# EAGLE schematic rc2014_8255 (EAGLE 7.6.0)
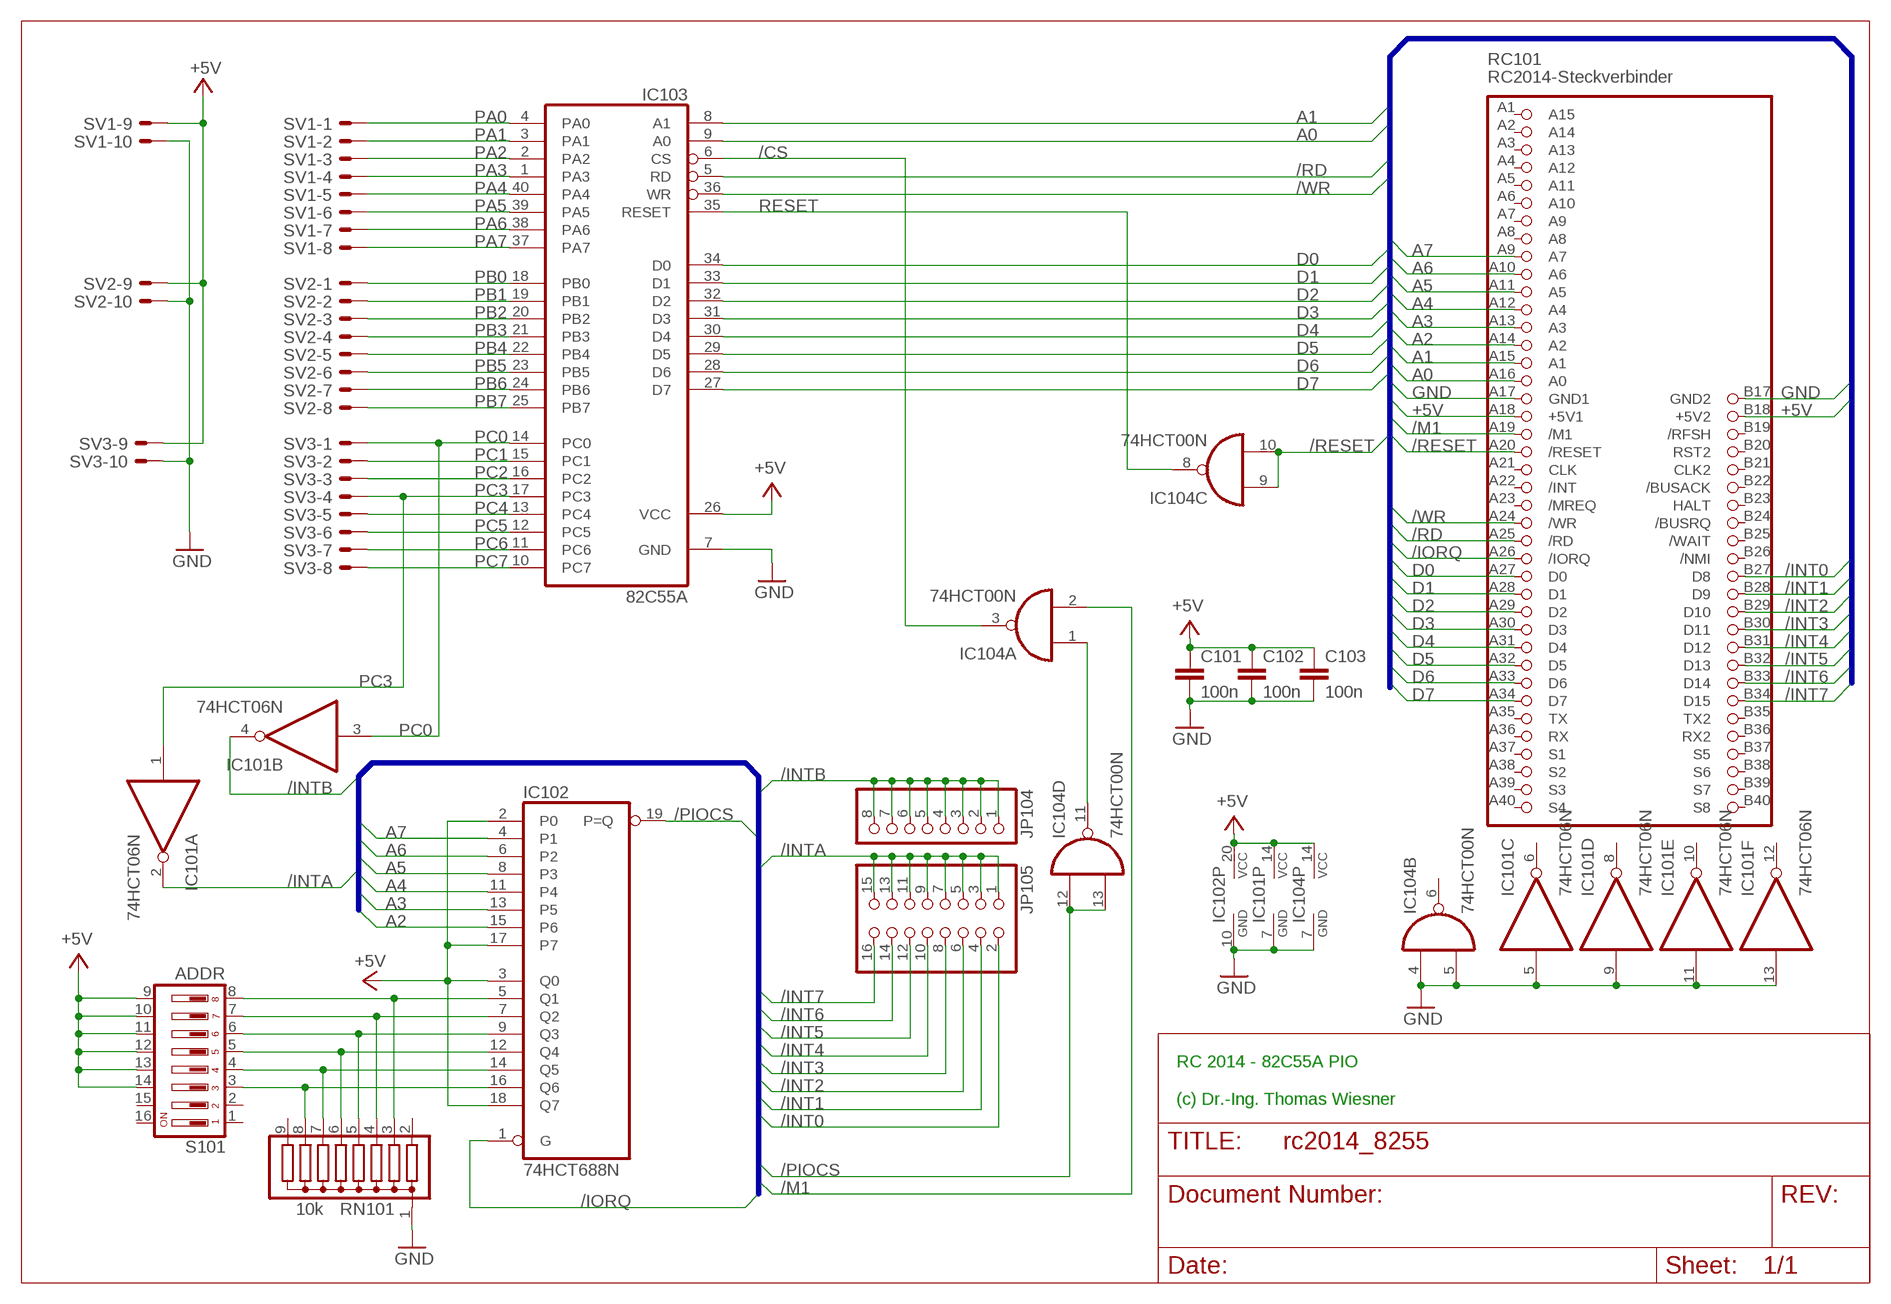
[diagram p0: schematic, sheet 1]

## Parts
C101  100n  C-EU025-025X050  [C025-025X050]
C102  100n  C-EU025-025X050  [C025-025X050]
C103  100n  C-EU025-025X050  [C025-025X050]
IC101  74HCT06N  74LS06N  [DIL14]
IC102  74HCT688N  [DIL20]
IC103  82C55A  [DIL40]
IC104  74HCT00N  74LS00N  [DIL14]
JP104  PINHD-1X8  [1X08]
JP105  PINHD-2X8  [2X08]
RC101  RC2014-Steckverbinder  RC2014STECKER  [RC2014-STECKER]
RN101  10k  G08R  [SIL9]
S101  ADDR  DS08  [DS-08]
SV1  ML10LE  [ML10L]
SV2  ML10LE  [ML10L]
SV3  ML10LE  [ML10L]

## Nets
+5V: C101.1 C102.1 C103.1 IC101.14(P:VCC) IC102.2(P0) IC102.3(Q0) IC102.17(P7) IC102.18(Q7) IC102.20(VCC) IC103.26(VCC) IC104.14(P:VCC) RC101.A18(+5V1) RC101.B18(+5V2) S101.9 S101.10 S101.11 S101.12 S101.13 S101.14 SV1.9 SV2.9 SV3.9
/CS: IC103.6(CS) IC104.3(A:O)
/INT0: JP105.2 RC101.B27(D8)
/INT1: JP105.4 RC101.B28(D9)
/INT2: JP105.6 RC101.B29(D10)
/INT3: JP105.8 RC101.B30(D11)
/INT4: JP105.10 RC101.B31(D12)
/INT5: JP105.12 RC101.B32(D13)
/INT6: JP105.14 RC101.B33(D14)
/INT7: JP105.16 RC101.B34(D15)
/INTA: IC101.2(A:O) JP105.1 JP105.3 JP105.5 JP105.7 JP105.9 JP105.11 JP105.13 JP105.15
/INTB: IC101.4(B:O) JP104.1 JP104.2 JP104.3 JP104.4 JP104.5 JP104.6 JP104.7 JP104.8
/IORQ: IC102.1(G) RC101.A26(/IORQ)
/M1: IC104.2(A:I1) RC101.A19(/M1)
/PIOCS: IC102.19(P=Q) IC104.12(D:I0) IC104.13(D:I1)
/RD: IC103.5(RD) RC101.A25(/RD)
/RESET: IC104.9(C:I0) IC104.10(C:I1) RC101.A20(/RESET)
/WR: IC103.36(WR) RC101.A24(/WR)
A0: IC103.9(A0) RC101.A16(A0)
A1: IC103.8(A1) RC101.A15(A1)
A2: IC102.15(P6) RC101.A14(A2)
A3: IC102.13(P5) RC101.A13(A3)
A4: IC102.11(P4) RC101.A12(A4)
A5: IC102.8(P3) RC101.A11(A5)
A6: IC102.6(P2) RC101.A10(A6)
A7: IC102.4(P1) RC101.A9(A7)
D0: IC103.34(D0) RC101.A27(D0)
D1: IC103.33(D1) RC101.A28(D1)
D2: IC103.32(D2) RC101.A29(D2)
D3: IC103.31(D3) RC101.A30(D3)
D4: IC103.30(D4) RC101.A31(D4)
D5: IC103.29(D5) RC101.A32(D5)
D6: IC103.28(D6) RC101.A33(D6)
D7: IC103.27(D7) RC101.A34(D7)
GND: C101.2 C102.2 C103.2 IC101.5(C:I) IC101.7(P:GND) IC101.9(D:I) IC101.11(E:I) IC101.13(F:I) IC102.10(GND) IC103.7(GND) IC104.4(B:I0) IC104.5(B:I1) IC104.7(P:GND) RC101.A17(GND1) RC101.B17(GND2) RN101.1 SV1.10 SV2.10 SV3.10
N$1: IC104.1(A:I0) IC104.11(D:O)
N$6: IC102.16(Q6) RN101.8 S101.3
N$7: IC102.14(Q5) RN101.7 S101.4
N$8: IC102.12(Q4) RN101.6 S101.5
N$9: IC102.9(Q3) RN101.5 S101.6
N$10: IC102.7(Q2) RN101.4 S101.7
N$11: IC102.5(Q1) RN101.3 S101.8
PA0: IC103.4(PA0) SV1.1
PA1: IC103.3(PA1) SV1.2
PA2: IC103.2(PA2) SV1.3
PA3: IC103.1(PA3) SV1.4
PA4: IC103.40(PA4) SV1.5
PA5: IC103.39(PA5) SV1.6
PA6: IC103.38(PA6) SV1.7
PA7: IC103.37(PA7) SV1.8
PB0: IC103.18(PB0) SV2.1
PB1: IC103.19(PB1) SV2.2
PB2: IC103.20(PB2) SV2.3
PB3: IC103.21(PB3) SV2.4
PB4: IC103.22(PB4) SV2.5
PB5: IC103.23(PB5) SV2.6
PB6: IC103.24(PB6) SV2.7
PB7: IC103.25(PB7) SV2.8
PC0: IC101.3(B:I) IC103.14(PC0) SV3.1
PC1: IC103.15(PC1) SV3.2
PC2: IC103.16(PC2) SV3.3
PC3: IC101.1(A:I) IC103.17(PC3) SV3.4
PC4: IC103.13(PC4) SV3.5
PC5: IC103.12(PC5) SV3.6
PC6: IC103.11(PC6) SV3.7
PC7: IC103.10(PC7) SV3.8
RESET: IC103.35(RESET) IC104.8(C:O)
Unconnected: IC101.6(C:O) IC101.8(D:O) IC101.10(E:O) IC101.12(F:O) IC104.6(B:O) RC101.A1(A15) RC101.A2(A14) RC101.A3(A13) RC101.A4(A12) RC101.A5(A11) RC101.A6(A10) RC101.A7(A9) RC101.A8 RC101.A21(CLK) RC101.A22(/INT) RC101.A23(/MREQ) RC101.A35(TX) RC101.A36(RX) RC101.A37(S1) RC101.A38(S2) RC101.A39(S3) RC101.A40(S4) RC101.B19(/RFSH) RC101.B20(RST2) RC101.B21(CLK2) RC101.B22(/BUSACK) RC101.B23(HALT) RC101.B24(/BUSRQ) RC101.B25(/WAIT) RC101.B26(/NMI) RC101.B35(TX2) RC101.B36(RX2) RC101.B37(S5) RC101.B38(S6) RC101.B39(S7) RC101.B40(S8) RN101.2 RN101.9 S101.1 S101.2 S101.15 S101.16

## Buses
SYSTEM

## Notes on the sheet
- RC 2014 - 82C55A PIO
  
  (c) Dr.-Ing. Thomas Wiesner

## Library data of the parts
C101-C103 = rcl:C-EU: CAPACITOR, European symbol
IC101 = 74xx-eu:74*06: Hex INVERTER, open collector high-voltage output
IC102 = 74xx-eu:74*688: 8-bit MAGNITUDE/IDENTITY COMPARATOR, totem pole
IC103 = micro-intel:82C55A: MICROCOMPUTER/PERIPHERAL DEVICE; MF: INTERSIL; MPN: IP82C55AZ; OC_FARNELL: 1562050; OC_NEWARK: 79K6939
IC104 = 74xx-eu:74*00: Quad 2-input NAND gate
JP104 = pinhead:PINHD-1X8: PIN HEADER
JP105 = pinhead:PINHD-2X8: PIN HEADER
RC101 = mbc:RC2014: RC-2014-Steckverbinder Modul
RN101 = resistor-sil:G08R: SIL RESISTOR; OC_FARNELL: unknown; OC_NEWARK: unknown
S101 = switch-dil:DS08: DIL/CODE SWITCH; MPN: DS08; OC_FARNELL: unknown; OC_NEWARK: 73J0071
SV1-SV3 = con-ml:ML10LE: HARTING; OC_FARNELL: unknown; OC_NEWARK: unknown